# Altium schematic sheet POWER.SchDoc
size A4
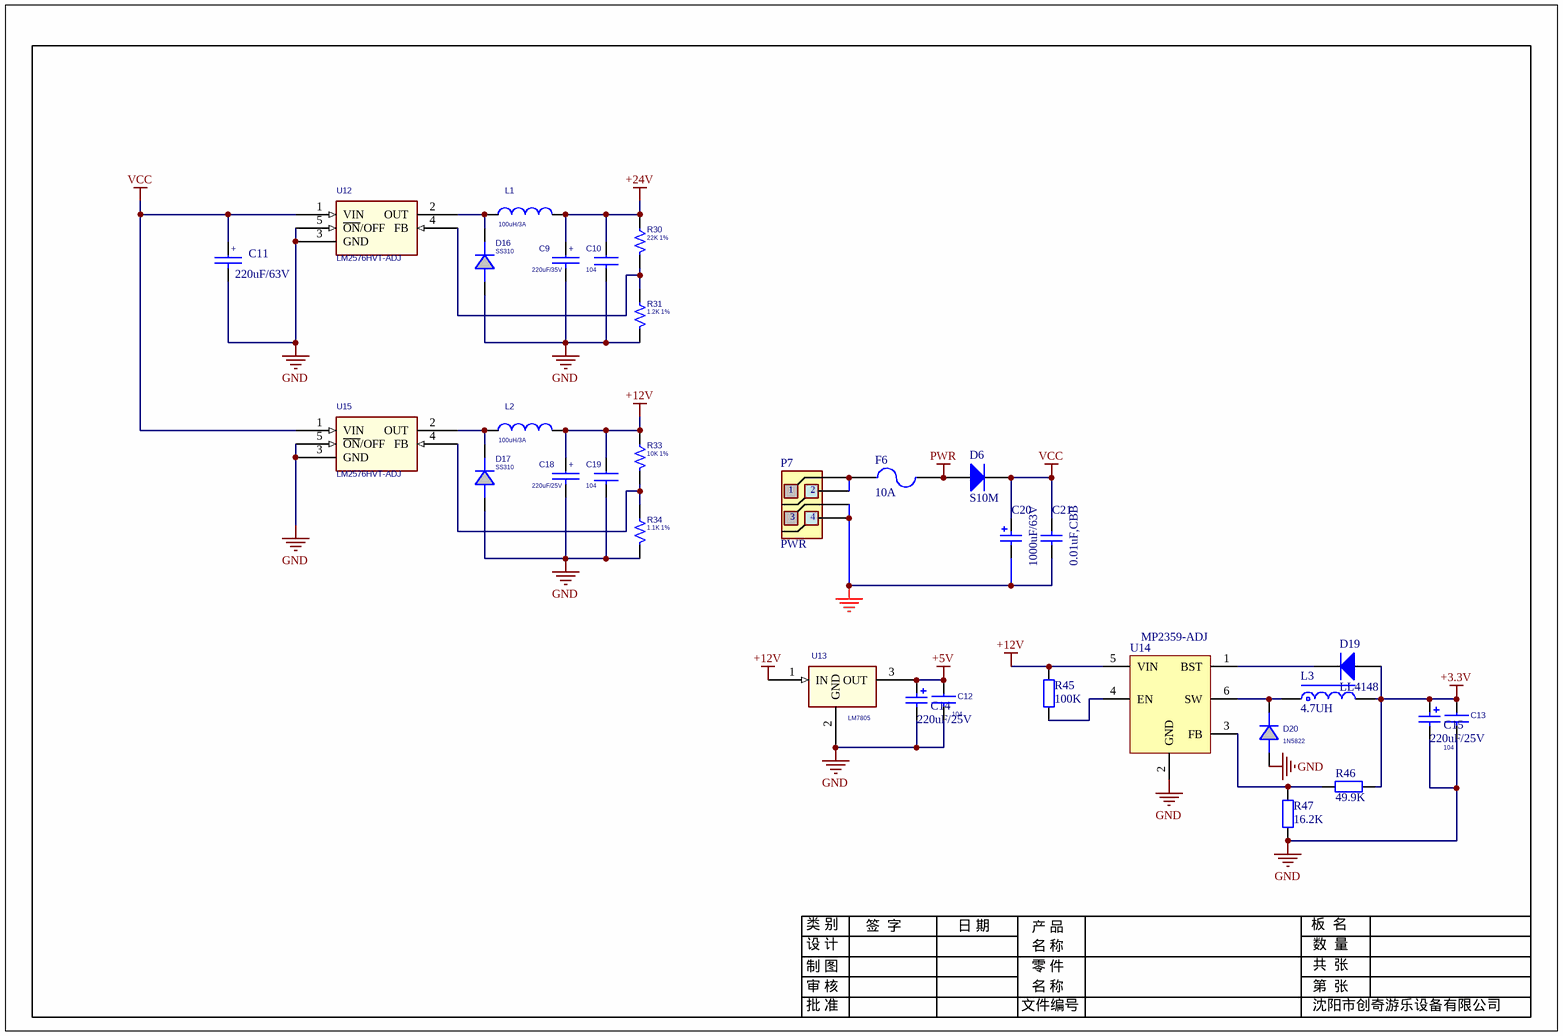
[diagram p0: POWER.SchDoc]

## Parts
C9  220uF/35V  [CAP 3.5*8*11.5]
C10  104  [C 0805]
C11  220uF/63V  [CAP 5.0*10*16]
C12  104  [C 0805]
C13  104  [C 0805]
C14  220uF/25V  [CAP 2.5*6.3*11.2 - BK]
C15  220uF/25V  [CAP 2.5*6.3*11.2 - BK]
C18  220uF/25V  [CAP 2.5*6.3*7]
C19  104  [C 0805]
C20  1000uF/63V  [CAP 7.5*16*25]
C21  0.01uF,CBB  [MLCC5.08-A]
D6  S10M  [SMC]
D16  SS310  [SMC]
D17  SS310  [SMC]
D19  LL4148  [MINI_MELF (LL34)]
D20  1N5822  [SMA]
F6  10A  [FUSEe-CAR]
L1  100uH/3A  [PK1618]
L2  100uH/3A  [PK1618]
L3  4.7UH  [CD31]
P7  PWR  [557-2x2]
R30  22K 1%  [R 0805]
R31  1.2K 1%  [R 0805]
R33  10K 1%  [R 0805]
R34  1.1K 1%  [R 0805]
R45  100K  [R 0805]
R46  49.9K  [R 0805]
R47  16.2K  [R 0805]
U12  LM2576HVT-ADJ  [TO220-5]
U13  LM7805  [TO220A]
U14  MP2359-ADJ  [SOT23-6L]
U15  LM2576HVT-ADJ  [TO220-5]

## Nets
+3.3V: C13.1 C15.1 D19.1 L3.2 R46.2
+5V: C12.1 C14.1 U13.3(OUT)
+12V: C18.1 C19.1 L2.2 R33.1 R45.1 U13.1(IN) U14.5(VIN)
+24V: C9.1 C10.1 L1.2 R30.1
GND: C9.2 C10.2 C11.2 C12.2 C13.2 C14.2 C15.2 C18.2 C19.2 C20.2 C21.1 D16.1(ANODE) D17.1(ANODE) D20.1(ANODE) P7.3 P7.4 R31.2 R34.2 R47.2 U12.3(GND) U12.5(~{ON}/OFF) U13.2(GND) U14.2(GND) U15.3(GND) U15.5(~{ON}/OFF)
PWR: D6.1 F6.1
VCC: C11.1 C20.1 C21.2 D6.2 U12.1(VIN) U15.1(VIN)
NetD16_2: D16.2(CATHODE) L1.1 U12.2(OUT)
NetD17_2: D17.2(CATHODE) L2.1 U15.2(OUT)
NetD19_2: D19.2 U14.1(BST)
NetD20_2: D20.2(CATHODE) L3.1 U14.6(SW)
NetF6_2: F6.2 P7.1 P7.2
NetR30_2: R30.2 R31.1 U12.4(FB)
NetR33_2: R33.2 R34.1 U15.4(FB)
NetR45_2: R45.2 U14.4(EN)
NetR46_1: R46.1 R47.1 U14.3(FB)

## Notes on the sheet
- 设 计
- 制 图
- 审 核
- 类 别
- 签  字
- 日 期
- 产 品
- 名 称
- 零 件
- 板  名
- 数  量
- 共  张
- 第  张
- 批 准
- 文件编号
- 沈阳市创奇游乐设备有限公司
- (in symbol CAP POL_3) +
- (in symbol CAP POL_4_1) +

## Library data of the parts
C9 C18 = CAP POL_3: 100uF/16V,100uF/35V; 100uF/16V: 100uF/16V; 100uF/35V: 100uF/35V
C10 C12 C13 C19 = CAP NP
C11 = CAP POL_4_1: 220uF/63V,470uF/50V; 470uF/50V: 470uF/50V; 220uF/63V: 220uF/63V
C14 C15 C20 = Cap Pol2: Polarized Capacitor (Axial); Published: 8-Jun-2000; LatestRevisionDate: 17-Jul-2002; LatestRevisionNote: Re-released for DXP Platform.; Publisher: Altium Limited
C21 = Cap: Capacitor; Published: 8-Jun-2000; LatestRevisionDate: 17-Jul-2002; LatestRevisionNote: Re-released for DXP Platform.; Publisher: Altium Limited
D6 D19 = Diode
D16 D17 = DIODE_1: S3M: S3M; SS310: SS310
D20 = DIODE
F6 = Fuse 2: Fuse; Published: 8-Jun-2000; LatestRevisionDate: 17-Jul-2002; LatestRevisionNote: Re-released for DXP Platform.; PackageReference: PIN-W2/E2.8; Publisher: Altium Limited
L1 L2 = INDUCTOR_2
L3 = L-CD: 贴片功率电感; BOM名称: 功率电感; 版权归属: 源创客; 学习资源: www.ooocke.com
P7 = CON4L
R30 R31 R33 R34 = RESISTOR 1
R45-R47 = Res1
U14 = MP2359: 输入：4.5V-24V  输出：0-15V 1.2A